# EAGLE design mwscoretransponder2013_rteam (EAGLE 7.1.0)
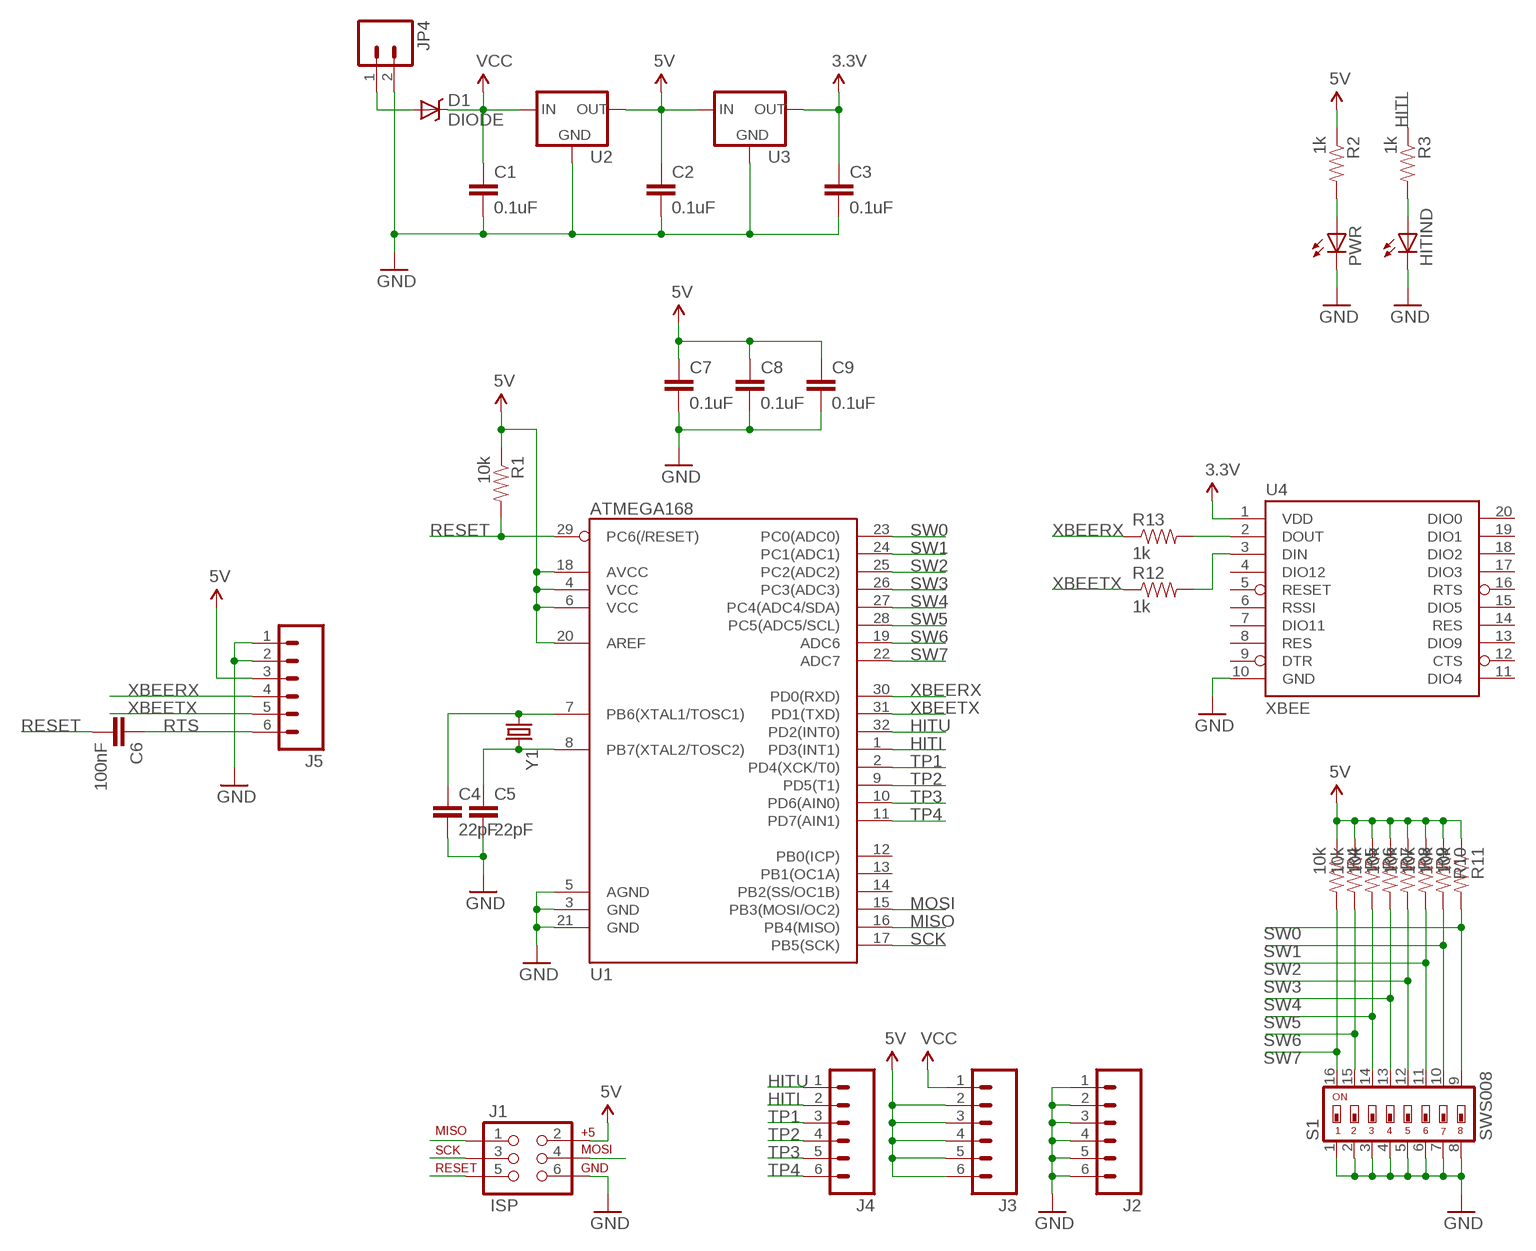
[diagram p0: schematic, sheet 1]

## Parts
C1  0.1uF  CAP0603-CAP  [0603-CAP]
C2  0.1uF  CAP0603-CAP  [0603-CAP]
C3  0.1uF  CAP0603-CAP  [0603-CAP]
C4  22pF  CAP0603-CAP  [0603-CAP]
C5  22pF  CAP0603-CAP  [0603-CAP]
C6  100nF  CAP0603-CAP  [0603-CAP]
C7  0.1uF  CAP0603-CAP  [0603-CAP]
C8  0.1uF  CAP0603-CAP  [0603-CAP]
C9  0.1uF  CAP0603-CAP  [0603-CAP]
D1  DIODE  DIODE-SCHOTTKY_  [SMA-DIODE]
HITIND  LED0603  [LED-0603]
J1  ISP  AVR_SPI_PRG_6PTH  [2X3]
J2  M06SIP  [1X06]
J3  M06SIP  [1X06]
J4  M06SIP  [1X06]
J5  M06SIP  [1X06]
JP4  M023.5MM_LOCK  [SCREWTERMINAL-3.5MM-2_LOCK]
PWR  LED0603  [LED-0603]
R1  10k  RESISTOR0603-RES  [0603-RES]
R2  1k  RESISTOR0603-RES  [0603-RES]
R3  1k  RESISTOR0603-RES  [0603-RES]
R4  10k  RESISTOR0603-RES  [0603-RES]
R5  10k  RESISTOR0603-RES  [0603-RES]
R6  10k  RESISTOR0603-RES  [0603-RES]
R7  10k  RESISTOR0603-RES  [0603-RES]
R8  10k  RESISTOR0603-RES  [0603-RES]
R9  10k  RESISTOR0603-RES  [0603-RES]
R10  10k  RESISTOR0603-RES  [0603-RES]
R11  10k  RESISTOR0603-RES  [0603-RES]
R12  1k  RESISTOR0603-RES  [0603-RES]
R13  1k  RESISTOR0603-RES  [0603-RES]
S1  SWS008  [SMS-008]
U1  ATMEGA168  [TQFP32-08]
U2  V_REG_MIC2920  [SOT223]
U3  V_REG_MIC2920  [SOT223]
U4  XBEE  XBEE-1B3  [XBEE-SMD]
Y1  CRYSTAL5X3  [CRYSTAL-SMD-5X3]

## Nets
3.3V: C3.1 U3.3(OUT) U4.1(VDD)
5V: C2.1 C7.1 C8.1 C9.1 J1.2 J3.2 J3.3 J3.4 J3.5 J3.6 J5.3 R1.1 R2.1 R4.1 R5.1 R6.1 R7.1 R8.1 R9.1 R10.1 R11.1 U1.4(VCC) U1.6(VCC) U1.18(AVCC) U1.20(AREF) U2.3(OUT) U3.1(IN)
GND: C1.2 C2.2 C3.2 C4.2 C5.2 C7.2 C8.2 C9.2 HITIND.C J1.6 J2.1 J2.2 J2.3 J2.4 J2.5 J2.6 J5.1 J5.2 JP4.2 PWR.C S1.1 S1.2 S1.3 S1.4 S1.5 S1.6 S1.7 S1.8 U1.3(GND) U1.5(AGND) U1.21(GND) U2.2(GND) U3.2(GND) U4.10(GND)
HITI: J4.2 R3.1 U1.1(PD3(INT1))
HITU: J4.1 U1.32(PD2(INT0))
MISO: J1.1 U1.16(PB4(MISO))
MOSI: J1.4 U1.15(PB3(MOSI/OC2))
N$1: PWR.A R2.2
N$2: HITIND.A R3.2
N$3: C4.1 U1.7(PB6(XTAL1/TOSC1)) Y1.1
N$4: D1.A JP4.1
N$6: C5.1 U1.8(PB7(XTAL2/TOSC2)) Y1.3
N$7: R13.2 U4.2(DOUT)
N$8: R12.2 U4.3(DIN)
RESET: C6.2 J1.5 R1.2 U1.29(PC6(/RESET))
RTS: C6.1 J5.6
SCK: J1.3 U1.17(PB5(SCK))
SW0: R11.2 S1.9 U1.23(PC0(ADC0))
SW1: R10.2 S1.10 U1.24(PC1(ADC1))
SW2: R9.2 S1.11 U1.25(PC2(ADC2))
SW3: R8.2 S1.12 U1.26(PC3(ADC3))
SW4: R7.2 S1.13 U1.27(PC4(ADC4/SDA))
SW5: R6.2 S1.14 U1.28(PC5(ADC5/SCL))
SW6: R5.2 S1.15 U1.19(ADC6)
SW7: R4.2 S1.16 U1.22(ADC7)
TP1: J4.3 U1.2(PD4(XCK/T0))
TP2: J4.4 U1.9(PD5(T1))
TP3: J4.5 U1.10(PD6(AIN0))
TP4: J4.6 U1.11(PD7(AIN1))
VCC: C1.1 D1.C J3.1 U2.1(IN)
XBEERX: J5.4 R13.1 U1.30(PD0(RXD))
XBEETX: J5.5 R12.1 U1.31(PD1(TXD))
Unconnected: U1.12(PB0(ICP)) U1.13(PB1(OC1A)) U1.14(PB2(SS/OC1B)) U4.4(DIO12) U4.5(RESET) U4.6(RSSI) U4.7(DIO11) U4.8(RES) U4.9(DTR) U4.11(DIO4) U4.12(CTS) U4.13(DIO9) U4.14(RES) U4.15(DIO5) U4.16(RTS) U4.17(DIO3) U4.18(DIO2) U4.19(DIO1) U4.20(DIO0)

## Library data of the parts
C1-C9 = SparkFun:CAP: Capacitor Standard 0603 ceramic capacitor, and 0.1" leaded capacitor.
D1 = SparkFun:DIODE-SCHOTTKY
HITIND PWR = SparkFun:LED: LEDs Standard schematic elements and footprints for 5mm, 3mm, 1206, and 0603 sized LEDs. 5mm - Spark Fun Electronics SKU : COM-00529 (and others)
J1 = SparkFun:AVR_SPI_PRG_6: AVR ISP 6 Pin This is the reduced ISP connector for AVR programming. Common on Arduino. This footprint will take up less PCB space and can be used with a 10-pin to 6-pin adapter such as SKU: BOB-08508
J2-J5 = SparkFun:M06: Header 6 Standard 6-pin 0.1" header. Use with straight break away headers (SKU : PRT-00116), right angle break away headers (PRT-00553), swiss pins (PRT-00743), machine pins (PRT-00117), and female headers (PRT-00115). Molex polarized connector foot print use with SKU : PRT-08094 with associated crimp pins and housings. NOTES ON THE VARIANTS LOCK and LOCK_LONGPADS... This footprint was designed to help hold the alignment of a through-hole component (i.e. 6-pin header) while soldering it into place. You may notice that each hole has been shifted either up or down by 0.005 of an inch from it's more standard position (which is a perfectly straight line). This slight alteration caused the pins (the squares in the middle) to touch the edges of the holes. Because they are alternating, it causes a "brace" to hold the component in place. 0.005 has proven to be the perfect amount of "off-center" position when using our standard breakaway headers. Although looks a little odd when you look at the bare footprint, once you have a header in there, the alteration is very hard to notice. Also, if you push a header all the way into place, it is covered up entirely on the bottom side. This idea of altering the position of holes to aid alignment will be further integrated into the Sparkfun Library for other footprints. It can help hold any component with 3 or more connection pins.
JP4 = SparkFun:M02: Header 2 Standard 2-pin 0.1" header. Use with straight break away headers (SKU : PRT-00116), right angle break away headers (PRT-00553), swiss pins (PRT-00743), machine pins (PRT-00117), and female headers (PRT-00115). Molex polarized connector foot print use with SKU : PRT-08233 with associated crimp pins and housings.
R1-R13 = SparkFun:RESISTOR: Resistor Basic schematic elements and footprints for 0603, 1206, and PTH resistors.
S1 = smd-special:SWS008: SMD Dip Switch 8 pol.
U1 = SparkFun:ATMEGA168
U2 U3 = SparkFun:V_REG_MIC2920: MIC2920A (http://www.micrel.com/_PDF/mic2920.pdf) - 400mA output LDO Regulator
U4 = SparkFun:XBEE-1
Y1 = SparkFun:CRYSTAL: Crystals Various standard crystals. Proven footprints. Spark Fun Electronics SKU : COM-00534

## Board
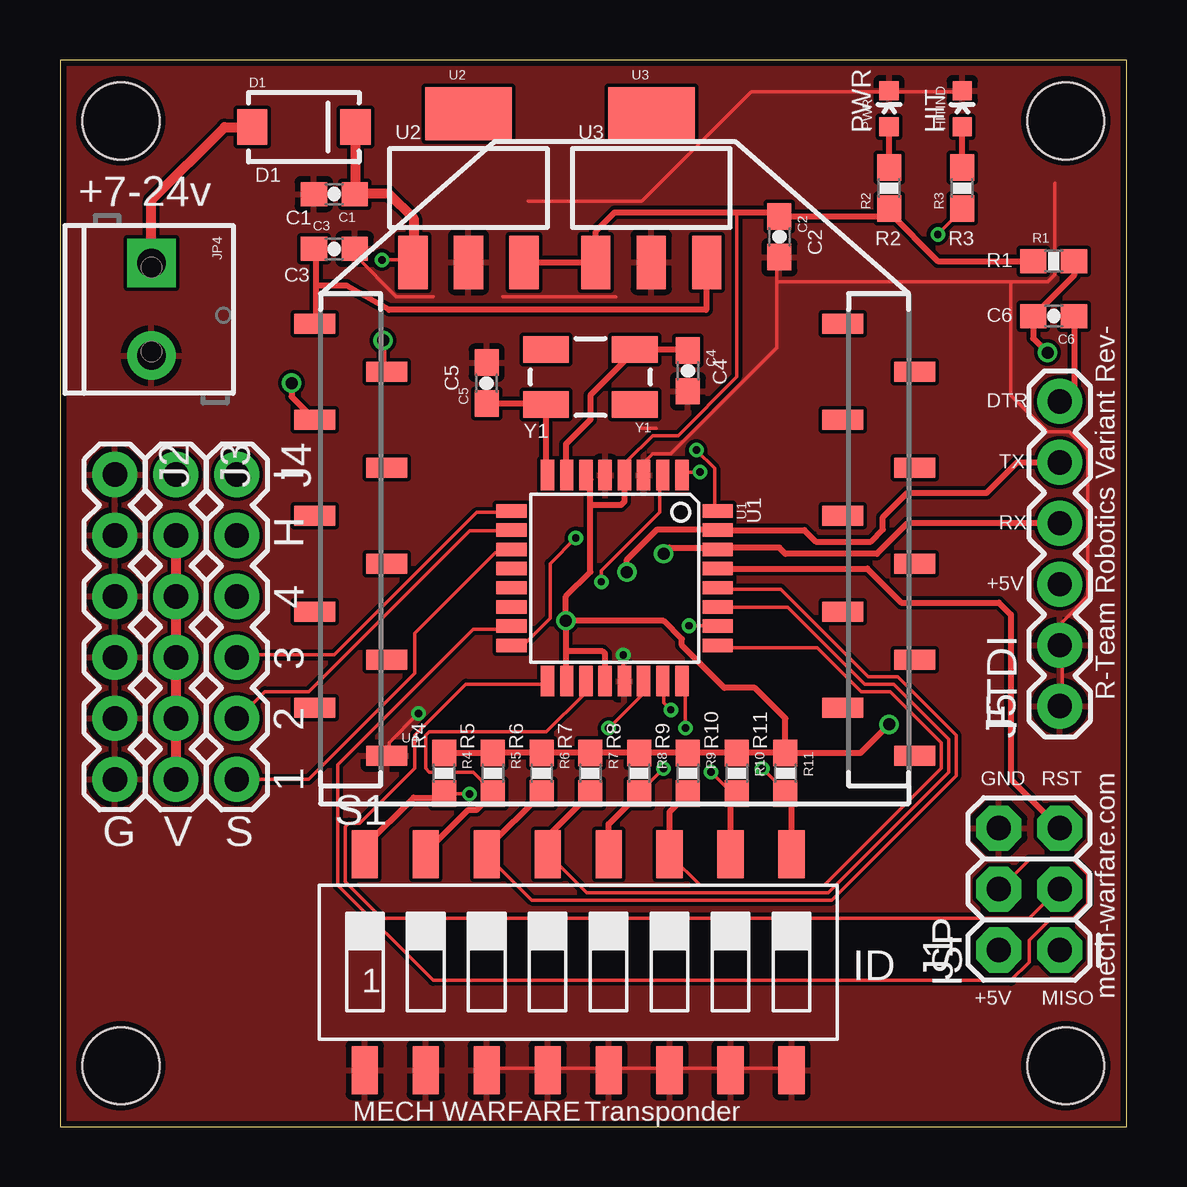
[diagram p1: board, top side]
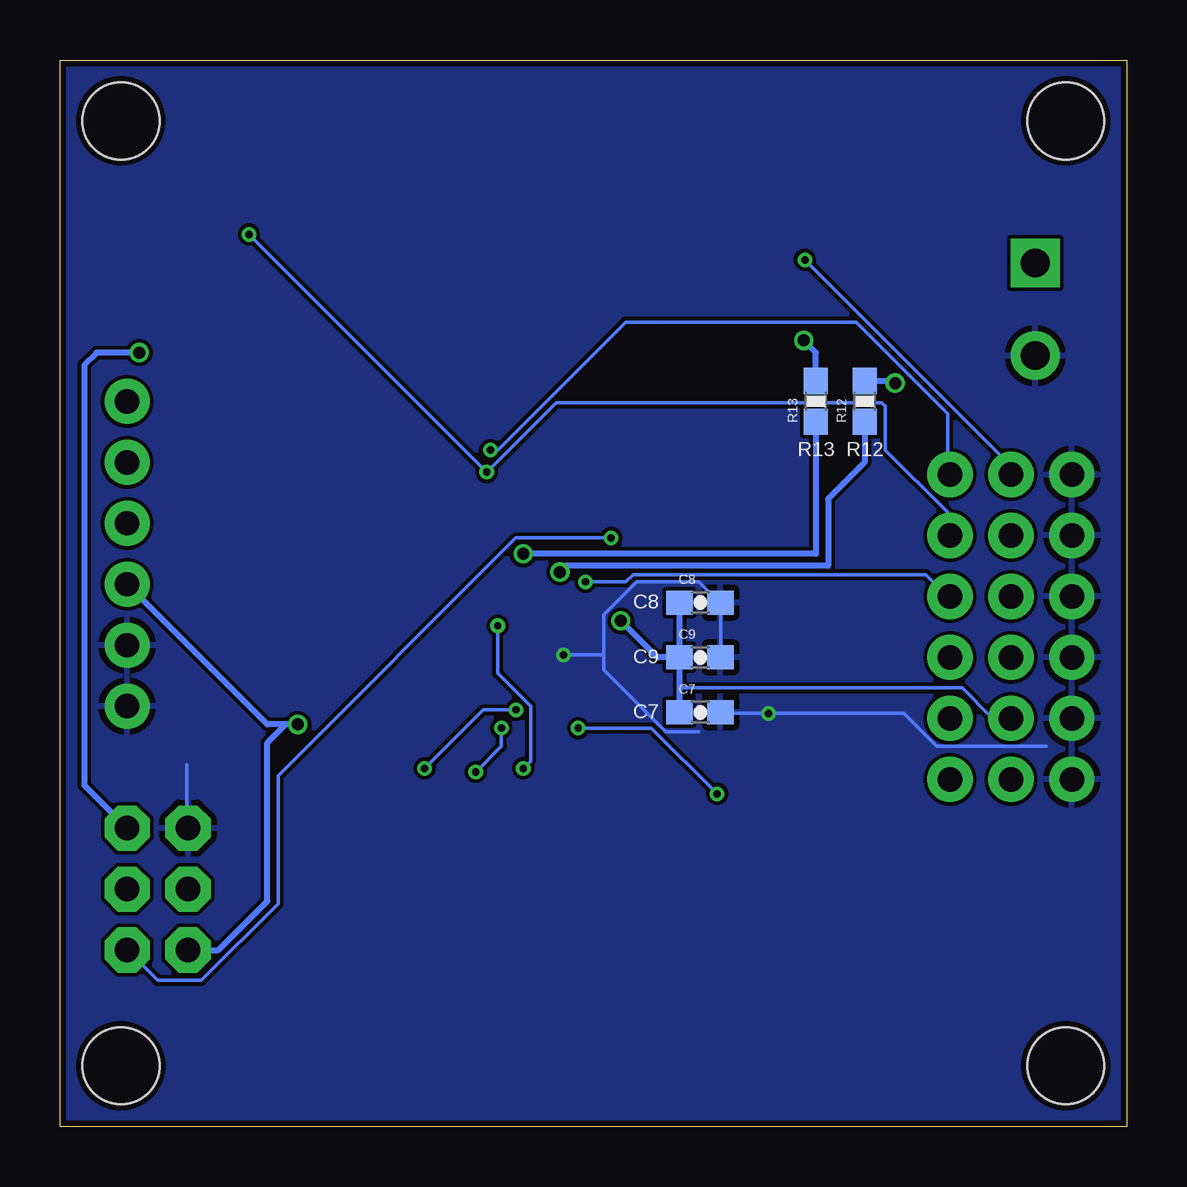
[diagram p2: board, bottom side, seen from below]

Size 44.45 x 44.45 mm. Coordinates in mm from the lower left corner, seen from the top.
Outline: 0,0 44.45,0 44.45,44.45 0,44.45 0,0
Copper layers (1*16): Top 0.035mm / dielectric 1.5mm / Bottom 0.035mm
Design rules "default": minimum track width 6mil, minimum drill 12mil, track to track 6mil, track to pad 6mil, pad to pad 6mil, via to via 6mil, smd to smd 0mil, copper to edge 10mil, drill to drill 10mil, minimum pad ring 10mil, minimum via ring 6mil, stop-mask expansion 2mil, vias tented up to drill 100mil, thermal gap 10mil
Holes 3.2 mm at 2.54,2.54 41.91,2.54 2.54,41.91 41.91,41.91

### Footprints (pad centres in the part's own frame; a part is rotated, then mirrored left to right if it is on the bottom)
0603-CAP = smd 1.1 x 1: 1 -0.85,0; 2 0.85,0
SMA-DIODE = smd 1.27 x 1.47: A -2.15,0; C 2.15,0
LED-0603 = smd 0.8 x 0.8: A 0,-0.75; C 0,0.75
2X3 = drill 1.016 pad 1.88 octagon: 1 0,0; 2 0,2.54; 3 2.54,0; 4 2.54,2.54; 5 5.08,0; 6 5.08,2.54
1X06 = drill 1.016 pad 1.88: 1 0,0; 2 2.54,0; 3 5.08,0; 4 7.62,0; 5 10.16,0; 6 12.7,0
SCREWTERMINAL-3.5MM-2_LOCK = drill 1.2 pad 2.032 square: 1 -0.178,0 | drill 1.2 pad 2.032: 2 3.678,0
0603-RES = smd 1.1 x 1: 1 -0.85,0; 2 0.85,0
SMS-008 = smd 1.092 x 2.007: 1 -8.89,-4.496; 2 -6.35,-4.496; 3 -3.81,-4.496; 4 -1.27,-4.496; 5 1.27,-4.496; 6 3.81,-4.496; 7 6.35,-4.496; 8 8.89,-4.496; 9 8.89,4.496; 10 6.35,4.496; 11 3.81,4.496; 12 1.27,4.496; 13 -1.27,4.496; 14 -3.81,4.496; 15 -6.35,4.496; 16 -8.89,4.496
TQFP32-08 = smd 1.27 x 0.559: 1 -4.293,2.8; 2 -4.293,2; 3 -4.293,1.2; 4 -4.293,0.4; 5 -4.293,-0.4; 6 -4.293,-1.2; 7 -4.293,-2; 8 -4.293,-2.8; 17 4.293,-2.8; 18 4.293,-2; 19 4.293,-1.2; 20 4.293,-0.4; 21 4.293,0.4; 22 4.293,1.2; 23 4.293,2; 24 4.293,2.8 | smd 0.559 x 1.27: 9 -2.8,-4.293; 10 -2,-4.293; 11 -1.2,-4.293; 12 -0.4,-4.293; 13 0.4,-4.293; 14 1.2,-4.293; 15 2,-4.293; 16 2.8,-4.293; 25 2.8,4.293; 26 2,4.293; 27 1.2,4.293; 28 0.4,4.293; 29 -0.4,4.293; 30 -1.2,4.293; 31 -2,4.293; 32 -2.8,4.293
SOT223 = smd 1.219 x 2.235: 1 -2.311,-3.099; 2 0,-3.099; 3 2.311,-3.099 | smd 3.6 x 2.2: 4 0,3.099
XBEE-SMD = smd 1.7 x 0.85: 1 -12.5,20; 2 -9.5,18; 3 -12.5,16; 4 -9.5,14; 5 -12.5,12; 6 -9.5,10; 7 -12.5,8; 8 -9.5,6; 9 -12.5,4; 10 -9.5,2; 11 12.5,2; 12 9.5,4; 13 12.5,6; 14 9.5,8; 15 12.5,10; 16 9.5,12; 17 12.5,14; 18 9.5,16; 19 12.5,18; 20 9.5,20
CRYSTAL-SMD-5X3 = smd 1.9 x 1.1: 1 -1.85,-1.15; 2 1.85,-1.15; 3 1.85,1.15; 4 -1.85,1.15

### Placement (x,y rotation side)
C1  11.43,38.86 180 top
C2  29.97,37.08 270 top
C3  11.43,36.58 0 top
C4  26.16,31.5 270 top
C5  17.78,30.99 90 top
C6  41.4,33.78 180 top
C7  17.78,17.27 0 bottom
C8  17.78,21.84 0 bottom
C9  17.78,19.56 0 bottom
D1  10.16,41.66 0 top
HITIND  37.59,42.42 0 top
J1  41.66,7.37 90 top
J2  2.29,27.18 270 top
J3  4.83,27.18 270 top
J4  7.37,27.18 270 top
J5  41.66,17.53 90 top
JP4  3.81,35.81 270 top
PWR  34.54,42.42 0 top
R1  41.4,36.07 0 top
R2  34.54,39.12 90 top
R3  37.59,39.12 90 top
R4  16,14.73 270 top
R5  18.03,14.73 270 top
R6  20.07,14.73 270 top
R7  22.1,14.73 270 top
R8  24.13,14.73 270 top
R9  26.16,14.73 270 top
R10  28.19,14.73 270 top
R11  30.23,14.73 270 top
R12  10.92,30.23 90 bottom
R13  12.95,30.23 90 bottom
S1  21.59,6.86 0 top
U1  23.11,22.86 270 top
U2  17.02,39.12 0 top
U3  24.64,39.12 0 top
U4  23.11,13.46 0 top
Y1  22.1,31.24 180 top

### Tracks (layer width: path | path; a pad name or v marks a point on that pad's centre or on a via)
3.3V
  Top 0.254: U3.3 26.92,36.02 26.92,34.04 13.72,34.04 11.94,35.05 10.67,35.05 | 10.67,35.05 10.67,36.49 C3.1 | U4.1 10.67,33.46 10.67,35.05
5V  (via drill 0.5 pad 0.3)
  Top 0.152: 28.19,38.1 28.19,31.24 25.76,28.8 24.69,28.8 23.62,27.74 23.62,27.28 U1.4
  Top 0.254: U2.3 U3.1 22.33,37.31 23.11,38.1 28.19,38.1 29.81,38.1 C2.1 34.21,37.93 R2.1 34.54,38.1 36.58,36.07 R1.1 | R4.1 R5.1 R6.1 R7.1 R8.1 R9.1 R10.1 R11.1 | 21.84,27.08 U1.6 22.1,26.97 22.1,25.91 | v21.08,21.08 21.08,19.81 | 21.08,19.81 21.08,18.6 U1.18 | v21.08,21.08 21.08,22.1 22.1,23.11 22.1,25.91 | U1.4 23.51,26.05 23.37,25.91 22.1,25.91 | U1.20 22.71,19.7 22.61,19.81 21.08,19.81 | R11.1 30.23,17.02 28.96,18.29 27.69,18.29 25.91,20.07 25.91,20.32 25.15,21.08 v21.08,21.08 | R11.1 33.36,15.58 v34.54,16.76
  Top 0.406: J3.2 J3.3 J3.4 J3.5 J3.6 4.83,13.97
  Bottom 0.152: 18.63,18.29 6.86,18.29 5.64,17.07 4.88,17.07 J3.5
  Bottom 0.254: C7.1 18.63,18.29 C9.1 | C9.1 C8.1 | C9.1 19.56,19.56 v21.08,21.08 | v34.54,16.76 35.05,16.76 | 35.05,16.76 35.81,16.76 J5.3 | J1.2 37.85,7.37 35.81,9.4 35.81,16 35.05,16.76
GND  (via drill 0.3)
  Top 0.152: S1.8 30.48,2.44 28.04,2.44 S1.7 27.89,2.44 25.45,2.44 S1.6 25.3,2.44 22.86,2.44 | S1.3 17.83,2.44 20.27,2.44 S1.4 20.42,2.44 22.86,2.44 | 22.86,2.44 S1.5 | 13.56,15.54 U4.10 13.72,15.54 13.72,16 v14.94,17.22 | v23.47,19.66 23.47,18.59 U1.21 | J5.1 41.76,17.53 41.76,19.96 J5.2 41.76,20.12 41.76,21.03 42.82,22.1 42.82,28.19 42.06,28.96 41.15,28.96 39.62,30.48 39.62,35.2 | 29.87,35.2 29.87,32.46 25.45,28.04 24.69,28.04 24.38,27.74 24.38,27.28 U1.3 | 29.87,35.2 29.87,36.12 C2.2 | 26.06,30.33 26.06,30.63 C4.2 | 24.23,29.11 24.84,29.11 | 22.86,27.74 22.86,27.28 U1.5 | 19.51,38.56 24.23,38.56 28.8,43.13 34.44,43.13 PWR.C 34.59,43.13 37.49,43.13 HITIND.C 37.64,43.13 | 17.07,36.12 U2.2 16.92,35.97 | 18.44,34.59 23.16,34.59 | 24.54,35.97 U3.2 | 15.54,34.59 14.02,34.59 12.34,36.27 12.34,36.58 C3.2 | 39.62,35.2 41.15,35.2 41.45,35.51 41.45,39.32 | 39.62,35.2 29.87,35.2
  Bottom 0.152: 17.83,16.46 19.2,16.46 21.79,19.05 21.79,19.66 | 21.79,19.66 21.79,21.34 20.42,22.71 17.83,22.71 17.07,21.95 C8.2 16.92,21.79 16.92,19.66 C9.2 | 17.07,17.22 C7.2 16.92,17.22 v14.94,17.22 9.3,17.22 7.92,15.85 3.35,15.85 | 21.79,19.66 v23.47,19.66 | 2.29,16.92 J2.5 | 39.17,15.09 39.17,12.5 J1.6 | 41.6,17.53 J5.1
  pour Bottom: -0.25,44.45 44.7,44.45 44.7,-0.25 -0.25,-0.25
  pour Top: -0.25,44.7 44.7,44.7 44.7,-0.25 -0.25,-0.25
HITI  (via drill 0.3)
  Top 0.152: v36.58,37.19 37.49,38.1 R3.1 | v26.67,27.28 26.06,27.28 U1.1
  Top 0.254: R3.1 37.59,38.1
  Bottom 0.152: v36.58,37.19 v26.67,27.28 23.77,30.18 10.21,30.18 10.06,30.02 10.06,28.19 7.47,25.6 7.47,24.69 J4.2
HITU  (via drill 0.3)
  Top 0.152: v26.52,28.19 27.28,27.43 27.28,25.76 U1.32
  Bottom 0.152: v26.52,28.19 26.21,28.19 20.88,33.53 11.28,33.53 7.47,29.72 7.47,27.28 J4.1
MISO  (via drill 0.3)
  Top 0.152: v21.49,24.54 20.42,23.47 20.42,21.18 19.36,20.12 18.9,20.12 U1.16
  Bottom 0.152: v21.49,24.54 25.45,24.54 35.36,14.63 35.36,9.3 38.56,6.1 40.39,6.1 J1.1
MOSI
  Top 0.152: U1.15 18.75,20.73 17.22,20.73 11.58,15.09 11.58,10.06 15.54,6.1 39.62,6.1 40.39,6.86 40.39,7.77 41.3,8.69 42.22,8.69 42.82,9.3 42.82,10.52 42.22,11.12 40.39,11.12 39.17,9.91 J1.4
N$1
  Top 0.254: R2.2 PWR.A
N$2
  Top 0.254: R3.2 HITIND.A
N$3
  Top 0.254: C4.1 26.12,32.39 Y1.1 23.95,32.33 22.1,30.48 22.1,29.46 21.08,28.45 21.08,27.18 U1.7
N$4
  Top 0.406: JP4.1 3.81,38.61 6.86,41.66 D1.A
N$6
  Top 0.254: C5.1 20.2,30.14 Y1.3 20.25,27.22 U1.8
N$7  (via drill 0.5 pad 0.3)
  Top 0.254: v13.46,32.77 13.46,31.61 U4.2
  Bottom 0.254: R13.2 12.95,32.26 v13.46,32.77
N$8  (via drill 0.5 pad 0.3)
  Top 0.254: v9.65,30.99 9.65,30.42 U4.3
  Bottom 0.254: R12.2 9.74,31.08 v9.65,30.99
RESET  (via drill 0.5 pad 0.3)
  Top 0.254: R1.2 42.25,35.48 C6.2 40.55,32.85 v41.15,32.26 | U1.29 33.64,23.26 35.05,21.84 39.12,21.84 39.62,21.34 39.62,14.48 J1.5
  Bottom 0.254: v41.15,32.26 42.93,32.26 43.43,31.75 43.43,14.22 J1.5
RTS
  Top 0.254: C6.1 42.25,30.82 J5.6
SCK
  Top 0.152: U1.17 20.27,18.44 16.92,18.44 14.78,16.31 14.78,14.94 12.5,12.65 12.04,12.65 11.89,12.5 11.89,10.21 13.41,8.69 40.39,8.69 41.6,9.91 J1.3
SW0  (via drill 0.3)
  Top 0.152: v25.45,17.37 25.15,17.68 25.15,18.44 U1.23 | v29.26,14.94 30.18,14.02 R11.2
  Top 0.254: S1.9 30.48,13.63 R11.2
  Bottom 0.152: v25.45,17.37 26.82,17.37 v29.26,14.94
SW1  (via drill 0.3)
  Top 0.152: v26.06,16.61 26.06,18.44 U1.24 | v27.13,14.78 28.04,13.87 R10.2
  Top 0.254: S1.10 27.94,13.63 R10.2
  Bottom 0.152: v26.06,16.61 26.06,15.85 v27.13,14.78
SW2
  Top 0.152: U1.25 27.43,19.96 31.55,19.96 33.38,18.14 34.59,18.14 36.73,16 36.73,14.94 31.85,10.06 26.67,10.06 25.45,11.28 S1.11
  Top 0.254: S1.11 25.4,13.12 R9.2
SW3  (via drill 0.3)
  Top 0.152: v26.21,20.88 27.28,20.88 U1.26 | v25.15,14.94 24.23,14.02 R8.2
  Top 0.254: S1.12 22.86,12.61 R8.2
  Bottom 0.152: v26.21,20.88 26.21,18.9 24.84,17.53 24.84,15.24 v25.15,14.94
SW4
  Top 0.152: U1.27 27.43,21.64 30.33,21.64 33.53,18.44 34.75,18.44 37.03,16.15 37.03,14.78 32,9.75 21.95,9.75 20.42,11.28 S1.13
  Top 0.254: S1.13 20.32,12.1 R7.2
SW5
  Top 0.152: U1.28 27.43,22.4 30.02,22.4 33.68,18.75 34.9,18.75 37.34,16.31 37.34,14.63 32.16,9.45 19.66,9.45 17.83,11.28 S1.14
  Top 0.254: S1.14 17.78,11.6 R6.2
SW6
  Top 0.152: U1.19 21.79,18.44 21.79,17.98 20.27,16.46 15.39,16.46 15.24,16.31 15.24,14.94 15.39,14.78 17.22,14.78 17.98,14.02 R5.2
  Top 0.254: S1.15 15.24,11.43 17.02,13.21 17.36,13.21 R5.2
SW7  (via drill 0.3)
  Top 0.152: v22.86,16.61 24.23,17.98 24.23,18.44 U1.22 | v17.07,13.87 16,13.87 R4.2
  Top 0.254: S1.16 12.7,11.68 14.73,13.72 15.84,13.72 R4.2
  Bottom 0.152: v22.86,16.61 19.81,16.61 v17.07,13.87
TP1  (via drill 0.3)
  Top 0.152: v22.55,22.71 22.55,23.16 24.99,25.6 24.99,27.13 U1.2
  Bottom 0.152: v22.55,22.71 20.88,22.71 20.57,23.01 8.38,23.01 7.47,22.1 J4.3
TP2
  Top 0.152: U1.9 18.75,25.6 17.37,25.6 11.43,19.66 7.47,19.66 J4.4
TP3
  Top 0.152: U1.10 18.75,24.84 17.07,24.84 10.36,18.14 8.53,18.14 7.47,17.07 J4.5
TP4
  Top 0.152: J4.6 10.36,14.48 14.78,18.9 14.78,20.57 18.14,23.93 18.75,23.93 U1.11
VCC  (via drill 0.3)
  Top 0.152: v13.41,36.12 14.63,36.12 U2.1
  Top 0.406: D1.C 12.31,38.89 | 12.31,38.89 C1.1 | 12.31,38.89 13.69,38.89 14.73,37.85 14.73,36.04 U2.1
  Bottom 0.152: v13.41,36.12 4.88,27.58 4.88,27.28 J3.1
XBEERX  (via drill 0.5 pad 0.3)
  Top 0.254: v25.15,23.88 25.4,24.13 27.34,24.13 U1.30 27.48,24.13 29.97,24.13 30.23,23.88 34.04,23.88 35.31,25.15 J5.4
  Bottom 0.254: R13.1 12.95,23.88 v25.15,23.88
XBEETX  (via drill 0.5 pad 0.3)
  Top 0.254: v23.62,23.11 23.62,23.62 24.89,24.89 27.38,24.89 U1.31 31.02,24.86 31.5,24.38 33.78,24.38 34.29,24.89 34.29,25.4 35.31,26.42 38.61,26.42 39.88,27.69 J5.5
  Bottom 0.254: R12.1 10.92,27.69 12.45,26.16 12.45,23.37 23.37,23.37 v23.62,23.11

### Text on the board
_tsilk: U2 | U3 | PWR | HIT | D1 | +7-24v | C1 | R2 | R3 | C3 | C2 | R1 | C6 | C5 | C4 | DTR | Y1 | I | TX | U1 | RX | H | 4 | +5V | 3 | R-Team Robotics Variant Rev- | 2 | FTDI | R4 | R5 | R6 | R7 | R8 | R9 | R10 | R11 | 1 | GND | RST | G | V | S | ID | ISP | +5V | MISO | mech-warfare.com | MECH WARFARE | Transponder
_bsilk: R12 | R13 | C8 | C9 | C7